# EasyEDA Pro project ProProject_IR sensor board_2024-06-21.epro, board PCB - old
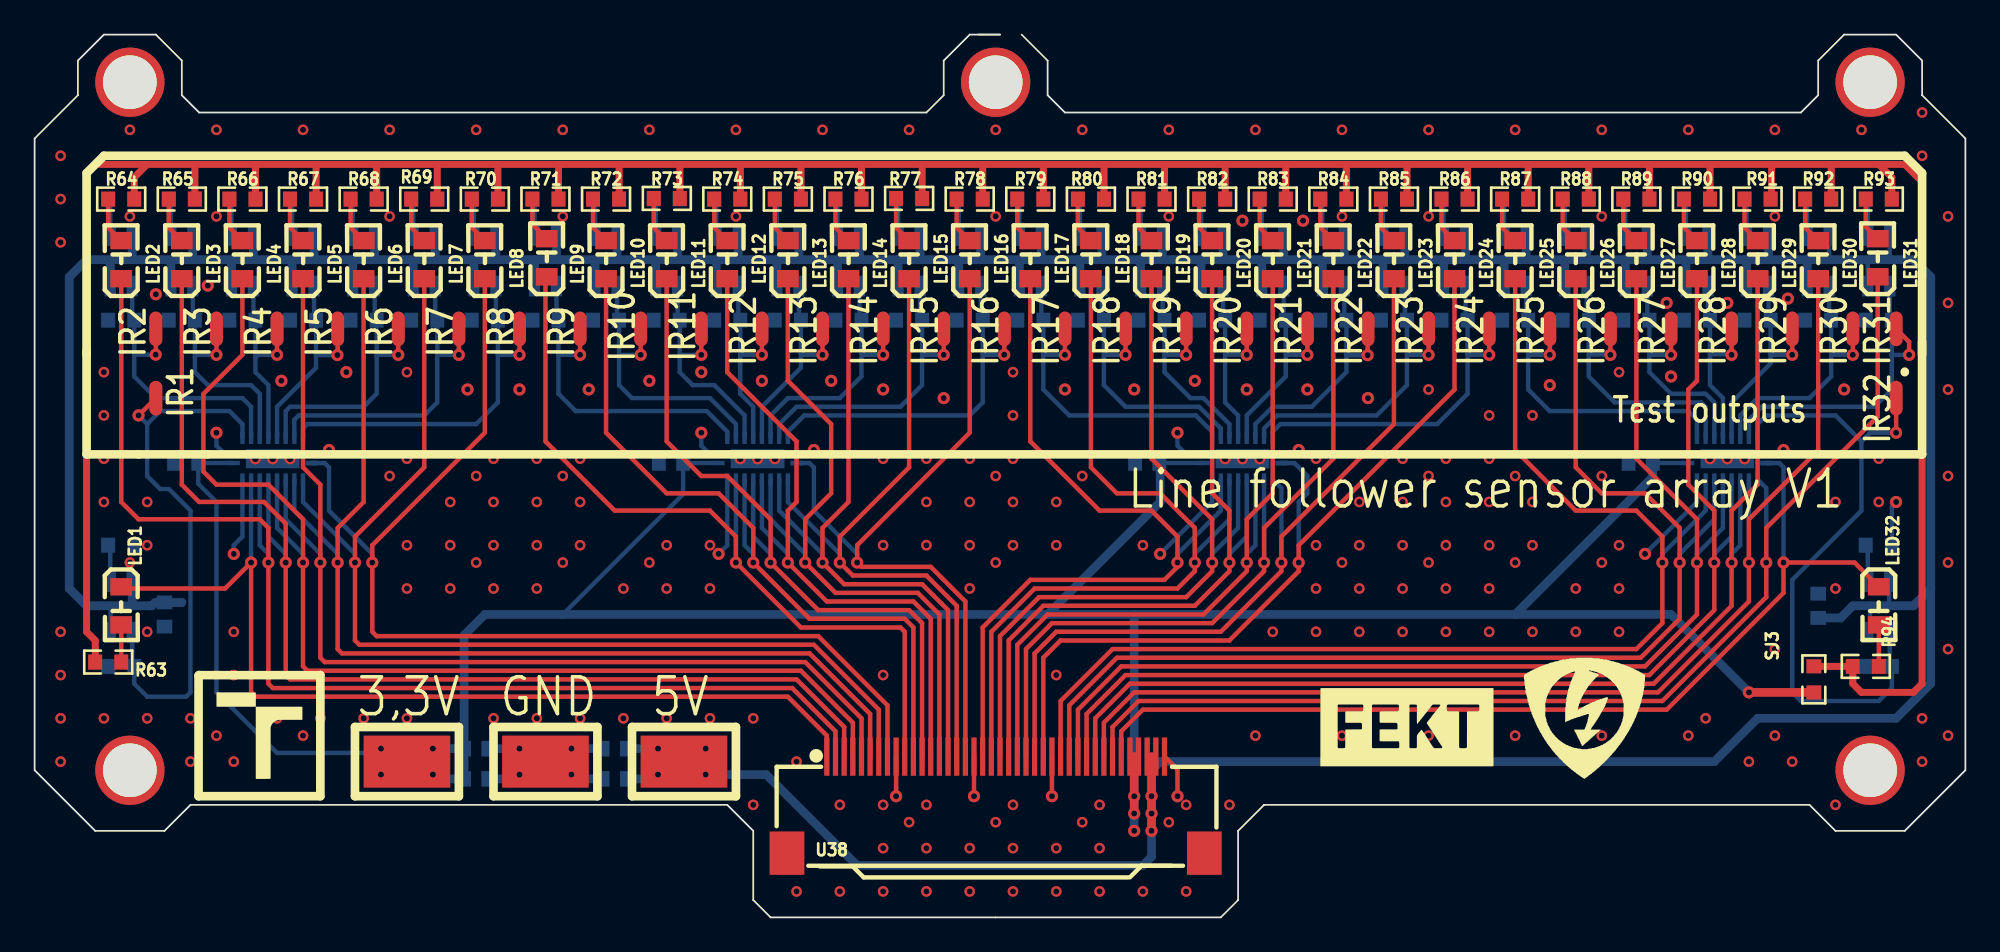
[diagram p1: board, top side]
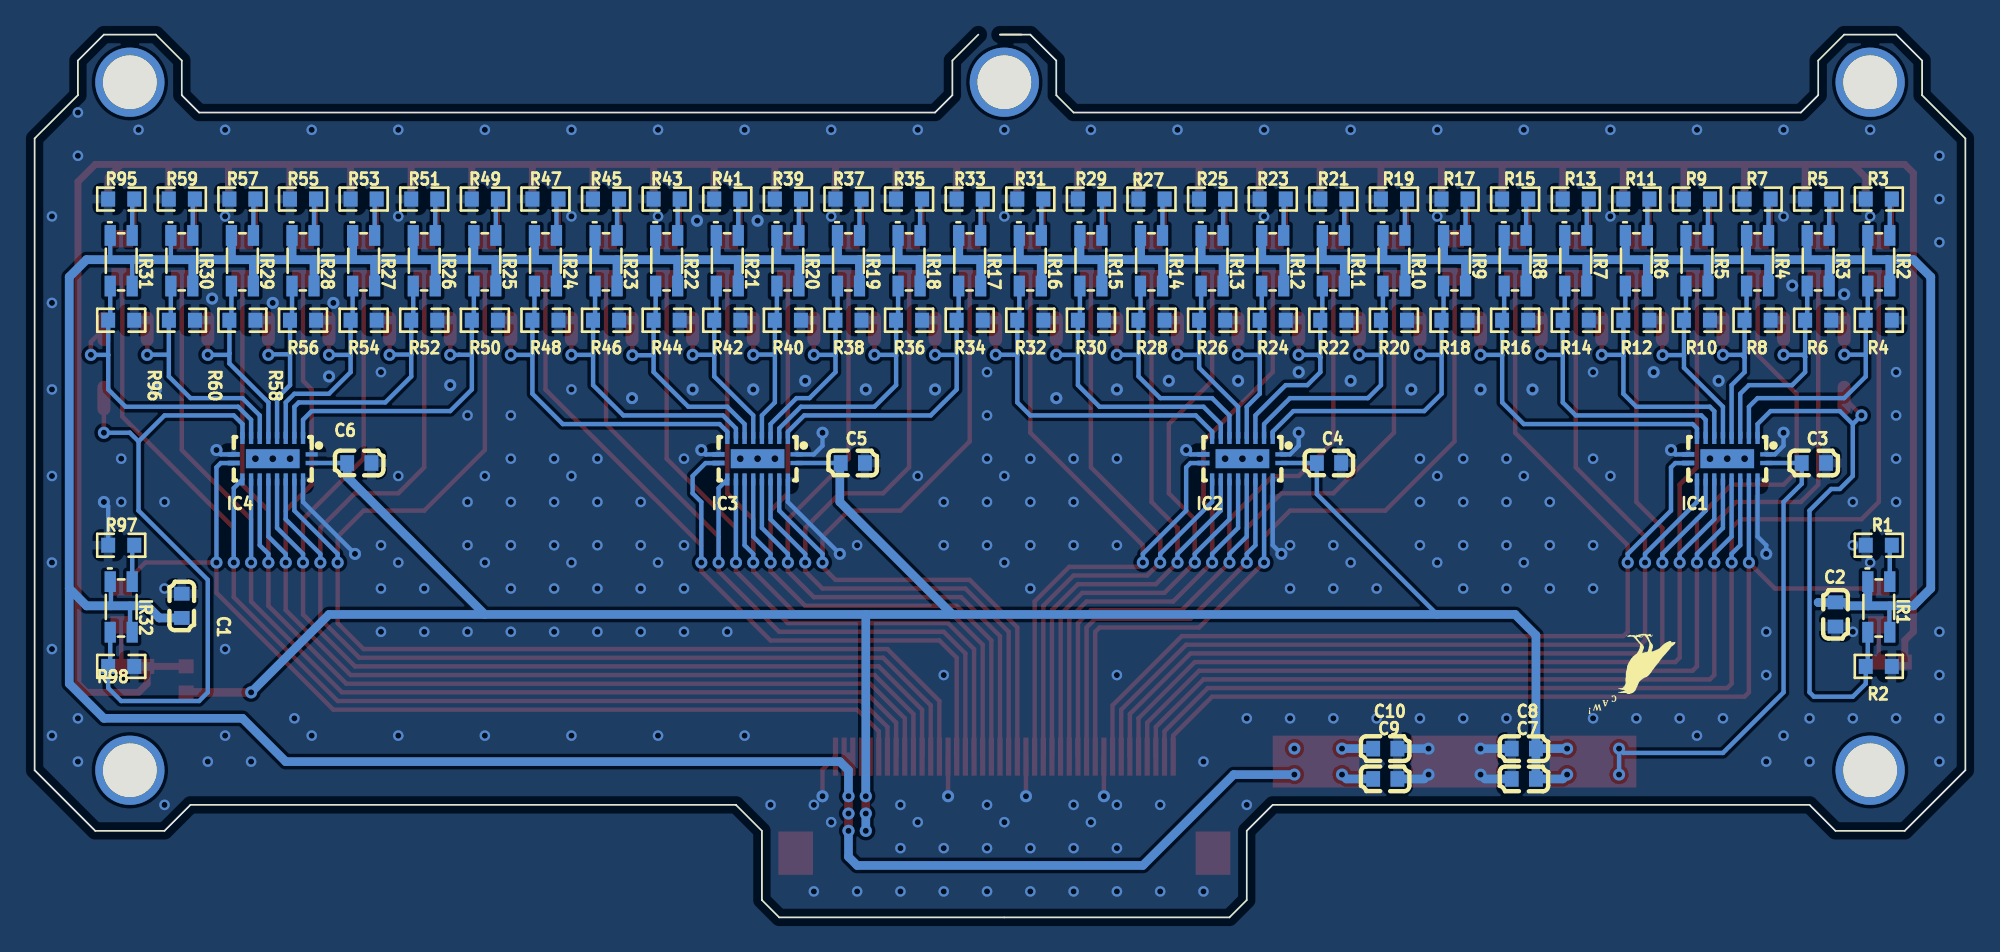
[diagram p2: board, bottom side, seen from below]

Outline 111.5 x 51 mm; copper layers: Top Layer, Bottom Layer. Coordinates in mm from the lower left corner of the outline.
Outline path: 54.5,51 55.75,51 54,51 52.5,49.5 52.5,47.5 51.5,46.5 9.5,46.5 8.5,47.5 8.5,49.5 7,51 4,51 2.5,49.5 2.5,47.5 0,45 0,8.5 3.5,5 7.5,5 9,6.5 40,6.5 41.5,5 41.5,1 42.5,0 68.5,0 69.5,1 69.5,5 71,6.5 102.5,6.5 104,5 108,5 111.5,8.5 111.5,45 109,47.5 109,49.5 107.5,51 104.5,51 103,49.5 103,47.5 102,46.5 59.5,46.5 58.5,47.5 58.5,49.5 57,51
Stack: Top Layer 0.035mm / Dielectric1 1.51mm FR4 er 4.5 / Bottom Layer 0.035mm

## Design rules (mm)
template: JLCPCB Capability(Two Layers Board)
spacing copperThickness1oz (default): track to track 0.102, other pairs 0.152 to 0.3
spacing copperThickness2oz: track to track 0.203, other pairs 0.152 to 0.3
track width copperThickness1oz (default): min 0.127, default 0.254, max 2.54
track width copperThickness2oz: min 0.203, default 0.254, max 2.54
differential pair differentialPair (default): width min 0.127, default 0.254, max 2.54; gap min 0.152, default 0.152
via viaSize (default): diameter min 0.5, default 0.61, max 10; hole min 0.3, default 0.305, max 6.3

## Placement (name value [footprint] x y rotation side)
C1  -  [C0603]  103 18 90 bottom
C2  -  [C0603]  7.5 17.5 270 bottom
C3  -  [C0603]  8.75 26.25 180 bottom
C4  -  [C0603]  36.75 26.25 180 bottom
C5  -  [C0603]  64.25 26.25 180 bottom
C6  -  [C0603]  92.75 26.25 180 bottom
C7  -  [C0603]  25.5 8 0 bottom
C8  -  [C0603]  25.5 9.75 0 bottom
C9  -  [C0603]  33.5 8 180 bottom
C10  -  [C0603]  33.5 9.75 180 bottom
IC1  -  [DHVQFN20_L4.5-W2.5-P0.50-BL-EP]  13.75 26.5 0 bottom
IC2  -  [DHVQFN20_L4.5-W2.5-P0.50-BL-EP]  41.75 26.5 0 bottom
IC3  -  [DHVQFN20_L4.5-W2.5-P0.50-BL-EP]  69.75 26.5 0 bottom
IC4  -  [DHVQFN20_L4.5-W2.5-P0.50-BL-EP]  97.75 26.5 0 bottom
IR1  -  [KU163]  5 18 180 bottom
IR2  -  [KU163]  5 38 180 bottom
IR3  -  [KU163]  8.5 38 180 bottom
IR4  -  [KU163]  12 38 180 bottom
IR5  -  [KU163]  15.5 38 180 bottom
IR6  -  [KU163]  19 38 180 bottom
IR7  -  [KU163]  22.5 38 180 bottom
IR8  -  [KU163]  26 38 180 bottom
IR9  -  [KU163]  29.5 38 180 bottom
IR10  -  [KU163]  33 38 180 bottom
IR11  -  [KU163]  36.5 38 180 bottom
IR12  -  [KU163]  40 38 180 bottom
IR13  -  [KU163]  43.5 38 180 bottom
IR14  -  [KU163]  47 38 180 bottom
IR15  -  [KU163]  50.5 38 180 bottom
IR16  -  [KU163]  54 38 180 bottom
IR17  -  [KU163]  57.5 38 180 bottom
IR18  -  [KU163]  61 38 180 bottom
IR19  -  [KU163]  64.5 38 180 bottom
IR20  -  [KU163]  68 38 180 bottom
IR21  -  [KU163]  71.5 38 180 bottom
IR22  -  [KU163]  75 38 180 bottom
IR23  -  [KU163]  78.5 38 180 bottom
IR24  -  [KU163]  82 38 180 bottom
IR25  -  [KU163]  85.5 38 180 bottom
IR26  -  [KU163]  89 38 180 bottom
IR27  -  [KU163]  92.5 38 180 bottom
IR28  -  [KU163]  96 38 180 bottom
IR29  -  [KU163]  99.5 38 180 bottom
IR30  -  [KU163]  103 38 180 bottom
IR31  -  [KU163]  106.5 38 180 bottom
IR32  -  [KU163]  106.5 18 180 bottom
LED1  -  [LED0805-RD_GREEN]  5 18 270 top
LED2  -  [LED0805-RD_GREEN]  5 38 90 top
LED3  -  [LED0805-RD_GREEN]  8.5 38 90 top
LED4  -  [LED0805-RD_GREEN]  12 38 90 top
LED5  -  [LED0805-RD_GREEN]  15.5 38 90 top
LED6  -  [LED0805-RD_GREEN]  19 38 90 top
LED7  -  [LED0805-RD_GREEN]  22.5 38 90 top
LED8  -  [LED0805-RD_GREEN]  26 38 90 top
LED9  -  [LED0805-RD_GREEN]  29.58 38.11 90 top
LED10  -  [LED0805-RD_GREEN]  33 38 90 top
LED11  -  [LED0805-RD_GREEN]  36.5 38 90 top
LED12  -  [LED0805-RD_GREEN]  40 38 90 top
LED13  -  [LED0805-RD_GREEN]  43.5 38 90 top
LED14  -  [LED0805-RD_GREEN]  47 38 90 top
LED15  -  [LED0805-RD_GREEN]  50.5 38 90 top
LED16  -  [LED0805-RD_GREEN]  54 38 90 top
LED17  -  [LED0805-RD_GREEN]  57.5 38 90 top
LED18  -  [LED0805-RD_GREEN]  61 38 90 top
LED19  -  [LED0805-RD_GREEN]  64.5 38 90 top
LED20  -  [LED0805-RD_GREEN]  68 38 90 top
LED21  -  [LED0805-RD_GREEN]  71.5 38 90 top
LED22  -  [LED0805-RD_GREEN]  75 38 90 top
LED23  -  [LED0805-RD_GREEN]  78.5 38 90 top
LED24  -  [LED0805-RD_GREEN]  82 38 90 top
LED25  -  [LED0805-RD_GREEN]  85.5 38 90 top
LED26  -  [LED0805-RD_GREEN]  89 38 90 top
LED27  -  [LED0805-RD_GREEN]  92.5 38 90 top
LED28  -  [LED0805-RD_GREEN]  96 38 90 top
LED29  -  [LED0805-RD_GREEN]  99.5 38 90 top
LED30  -  [LED0805-RD_GREEN]  103 38 90 top
LED31  -  [LED0805-RD_GREEN]  106.44 38.11 90 top
LED32  -  [LED0805-RD_GREEN]  106.5 18 270 top
NOREF  -  [Pad_e9365]  70 34 90 top
NOREF#2  -  [Pad_e9362]  80.5 34 90 top
NOREF#3  -  [Pad_e9367]  63 34 90 top
NOREF#4  -  [Pad_e9366]  66.5 34 90 top
NOREF#5  -  [Pad_e9358]  94.5 34 90 top
NOREF#6  -  [Pad_e9375]  38.5 34 90 top
NOREF#7  -  [Pad_e9369]  56 34 90 top
NOREF#8  -  [Pad_e9356]  101.5 34 90 top
NOREF#9  -  [Pad_e4480]  37.5 9 0 top
NOREF#10  -  [Pad_e8278]  5.5 48.25 0 top
NOREF#11  -  [Pad_e9355]  105 34 90 top
NOREF#12  -  [Pad_e9389]  7 30 90 top
NOREF#13  -  [Pad_e9378]  28 34 90 top
NOREF#14  -  [Pad_e8274]  55.5 48.25 0 top
NOREF#15  -  [Pad_e9371]  49 34 90 top
NOREF#16  -  [Pad_e4581]  21.5 9 0 top
NOREF#17  -  [Pad_e9379]  24.5 34 90 top
NOREF#18  -  [Pad_e9372]  45.5 34 90 top
NOREF#19  -  [Pad_e8276]  106 48.25 0 top
NOREF#20  -  [Pad_e4442]  106 8.5 0 top
NOREF#21  -  [Pad_e9382]  14 34 90 top
NOREF#22  -  [Pad_e4472]  29.5 9 0 top
NOREF#23  -  [Pad_e9368]  59.5 34 90 top
NOREF#24  -  [Pad_e9360]  87.5 34 90 top
NOREF#25  -  [Pad_e9357]  98 34 90 top
NOREF#26  -  [Pad_e9363]  77 34 90 top
NOREF#27  -  [Pad_e9380]  21 34 90 top
NOREF#28  -  [Pad_e9394]  107.5 30 90 top
NOREF#29  -  [Pad_e9376]  35 34 90 top
NOREF#30  -  [Pad_e9385]  7 34 90 top
NOREF#31  -  [Pad_e9383]  10.5 34 90 top
NOREF#32  -  [Pad_e9377]  31.5 34 90 top
NOREF#33  -  [Pad_e4440]  5.5 8.5 0 top
NOREF#34  -  [Pad_e9381]  17.5 34 90 top
NOREF#35  -  [Pad_e9370]  52.5 34 90 top
NOREF#36  -  [Pad_e9364]  73.5 34 90 top
NOREF#37  -  [Pad_e9373]  42 34 90 top
NOREF#38  -  [Pad_e9359]  91 34 90 top
NOREF#39  -  [Pad_e9354]  107.5 34 90 top
NOREF#40  -  [Pad_e9361]  84 34 90 top
R1  -  [R0603]  5 21.5 0 bottom
R2  -  [R0603]  5 14.5 0 bottom
R3  -  [R0603]  5 41.5 0 bottom
R4  -  [R0603]  5 34.5 0 bottom
R5  -  [R0603]  8.5 41.5 0 bottom
R6  -  [R0603]  8.5 34.5 0 bottom
R7  -  [R0603]  12 41.5 0 bottom
R8  -  [R0603]  12 34.5 0 bottom
R9  -  [R0603]  15.5 41.5 0 bottom
R10  -  [R0603]  15.5 34.5 0 bottom
R11  -  [R0603]  19 41.5 0 bottom
R12  -  [R0603]  19 34.5 0 bottom
R13  -  [R0603]  22.5 41.5 0 bottom
R14  -  [R0603]  22.5 34.5 0 bottom
R15  -  [R0603]  26 41.5 0 bottom
R16  -  [R0603]  26 34.5 0 bottom
R17  -  [R0603]  29.5 41.5 0 bottom
R18  -  [R0603]  29.5 34.5 0 bottom
R19  -  [R0603]  33 41.5 0 bottom
R20  -  [R0603]  33 34.5 0 bottom
R21  -  [R0603]  36.5 41.5 0 bottom
R22  -  [R0603]  36.5 34.5 0 bottom
R23  -  [R0603]  40 41.5 0 bottom
R24  -  [R0603]  40 34.5 0 bottom
R25  -  [R0603]  43.5 41.5 0 bottom
R26  -  [R0603]  43.5 34.5 0 bottom
R27  -  [R0603]  47 41.5 0 bottom
R28  -  [R0603]  47 34.5 0 bottom
R29  -  [R0603]  50.5 41.5 0 bottom
R30  -  [R0603]  50.5 34.5 0 bottom
R31  -  [R0603]  54 41.5 0 bottom
R32  -  [R0603]  54 34.5 0 bottom
R33  -  [R0603]  57.5 41.5 0 bottom
R34  -  [R0603]  57.5 34.5 0 bottom
R35  -  [R0603]  61 41.5 0 bottom
R36  -  [R0603]  61 34.5 0 bottom
R37  -  [R0603]  64.5 41.5 0 bottom
R38  -  [R0603]  64.5 34.5 0 bottom
R39  -  [R0603]  68 41.5 0 bottom
R40  -  [R0603]  68 34.5 0 bottom
R41  -  [R0603]  71.5 41.5 0 bottom
R42  -  [R0603]  71.5 34.5 0 bottom
R43  -  [R0603]  75 41.5 0 bottom
R44  -  [R0603]  75 34.5 0 bottom
R45  -  [R0603]  78.5 41.5 0 bottom
R46  -  [R0603]  78.5 34.5 0 bottom
R47  -  [R0603]  82 41.5 0 bottom
R48  -  [R0603]  82 34.5 0 bottom
R49  -  [R0603]  85.5 41.5 0 bottom
R50  -  [R0603]  85.5 34.5 0 bottom
R51  -  [R0603]  89 41.5 0 bottom
R52  -  [R0603]  89 34.5 0 bottom
R53  -  [R0603]  92.5 41.5 0 bottom
R54  -  [R0603]  92.5 34.5 0 bottom
R55  -  [R0603]  96 41.5 0 bottom
R56  -  [R0603]  96 34.5 0 bottom
R57  -  [R0603]  99.5 41.5 0 bottom
R58  -  [R0603]  99.5 34.5 0 bottom
R59  -  [R0603]  103 41.5 0 bottom
R60  -  [R0603]  102.99 34.5 0 bottom
R63  -  [R0603]  4.25 14.75 180 top
R64  -  [R0603]  5 41.5 0 top
R65  -  [R0603]  8.5 41.5 0 top
R66  -  [R0603]  12 41.5 0 top
R67  -  [R0603]  15.5 41.5 0 top
R68  -  [R0603]  19 41.5 0 top
R69  -  [R0603]  22.5 41.5 0 top
R70  -  [R0603]  26 41.5 0 top
R71  -  [R0603]  29.5 41.5 0 top
R72  -  [R0603]  33 41.5 0 top
R73  -  [R0603]  36.51 41.54 0 top
R74  -  [R0603]  40 41.5 0 top
R75  -  [R0603]  43.5 41.5 0 top
R76  -  [R0603]  47 41.5 0 top
R77  -  [R0603]  50.5 41.54 0 top
R78  -  [R0603]  54 41.5 0 top
R79  -  [R0603]  57.5 41.5 0 top
R80  -  [R0603]  61 41.5 0 top
R81  -  [R0603]  64.5 41.5 0 top
R82  -  [R0603]  68 41.5 0 top
R83  -  [R0603]  71.5 41.5 0 top
R84  -  [R0603]  75 41.5 0 top
R85  -  [R0603]  78.5 41.5 0 top
R86  -  [R0603]  82 41.5 0 top
R87  -  [R0603]  85.5 41.5 0 top
R88  -  [R0603]  89 41.5 0 top
R89  -  [R0603]  92.5 41.5 0 top
R90  -  [R0603]  96 41.5 0 top
R91  -  [R0603]  99.5 41.5 0 top
R92  -  [R0603]  103 41.5 0 top
R93  -  [R0603]  106.5 41.5 0 top
R94  -  [R0603]  105.75 14.5 180 top
R95  -  [R0603]  106.5 41.5 0 bottom
R96  -  [R0603]  106.5 34.5 0 bottom
R97  -  [R0603]  106.5 21.5 0 bottom
R98  -  [R0603]  106.5 14.5 0 bottom
SJ3  -  [R0603]  102.75 13.75 270 top
U38  -  [CONN-SMD_40P-P0.50_F31L-1A7H1-21040]  55.5 6.5 0 top

## Footprints (pads in the part's own frame, mm; a bottom-side part is the same pattern mirrored in y, then rotated)
C0603
  rect 0.8x0.9 smd: 1(-0.7,0) 2(0.7,0)
CONN-SMD_40P-P0.50_F31L-1A7H1-21040
  rect 0.3x2.2 smd: 1(-9.75,2.788) 2(-9.25,2.788) 3(-8.75,2.788) 4(-8.25,2.788) 5(-7.75,2.788) 6(-7.25,2.788) 7(-6.75,2.788) 8(-6.25,2.788) 9(-5.75,2.788) 10(-5.25,2.788) 11(-4.75,2.788) 12(-4.25,2.788) 13(-3.75,2.788) 14(-3.25,2.788) 15(-2.75,2.788) 16(-2.25,2.788) 17(-1.75,2.788) 18(-1.25,2.788) 19(-0.75,2.788) 20(-0.25,2.788) 21(0.25,2.788) 22(0.75,2.788) 23(1.25,2.788) 24(1.75,2.788) 25(2.25,2.788) 26(2.75,2.788) 27(3.25,2.788) 28(3.75,2.788) 29(4.25,2.788) 30(4.75,2.788) 31(5.25,2.788) 32(5.75,2.788) 33(6.25,2.788) 34(6.75,2.788) 35(7.25,2.788) 36(7.75,2.788) 37(8.25,2.788) 38(8.75,2.788) 39(9.25,2.788) 40(9.75,2.788)
  rect 2x2.5 smd: 41(-12.05,-2.788) 42(12.05,-2.788)
DHVQFN20_L4.5-W2.5-P0.50-BL-EP
  rect 0.7x0.25 smd: 1(-2.251,-0.249) 20(-2.251,0.249)
  rect 0.25x0.7 smd: 2(-1.75,-1.2) 3(-1.25,-1.2) 4(-0.75,-1.2) 5(-0.25,-1.2) 6(0.25,-1.2) 7(0.75,-1.2) 8(1.25,-1.2) 9(1.75,-1.2) 12(1.75,1.2) 13(1.25,1.2) 14(0.75,1.2) 15(0.25,1.2) 16(-0.25,1.2) 17(-0.75,1.2) 18(-1.25,1.2) 19(-1.75,1.2)
  rect 0.7x0.28 smd: 10(2.251,-0.249) 11(2.251,0.251)
  rect 3.1x1.1 smd: 21(0,0.001)
KU163
  rect 0.65x1.2 smd: 1(-0.635,1.397) 2(0.635,1.397) 3(-0.635,-1.524) 4(0.635,-1.524)
LED0805-RD_GREEN
  rect 1x1.25 smd: 1(-1.1,0) 2(1.1,0)
Pad_e4440
  round 4 hole 3.1: 1(0,0)
Pad_e4442
  round 4 hole 3.1: 1(0,0)
Pad_e4472
  rect 5x3 smd: 2(0,0)
Pad_e4480
  rect 5x3 smd: 43(0,0)
Pad_e4581
  rect 5x3 smd: 44(0,0)
Pad_e8274
  round 4 hole 3.1: 45(0,0)
Pad_e8276
  round 4 hole 3.1: 45(0,0)
Pad_e8278
  round 4 hole 3.1: 45(0,0)
Pad_e9354
  oval 2x0.75 smd: 45(0,0)
Pad_e9355
  oval 2x0.75 smd: 46(0,0)
Pad_e9356
  oval 2x0.75 smd: 47(0,0)
Pad_e9357
  oval 2x0.75 smd: 48(0,0)
Pad_e9358
  oval 2x0.75 smd: 49(0,0)
Pad_e9359
  oval 2x0.75 smd: 50(0,0)
Pad_e9360
  oval 2x0.75 smd: 51(0,0)
Pad_e9361
  oval 2x0.75 smd: 52(0,0)
Pad_e9362
  oval 2x0.75 smd: 53(0,0)
Pad_e9363
  oval 2x0.75 smd: 54(0,0)
Pad_e9364
  oval 2x0.75 smd: 55(0,0)
Pad_e9365
  oval 2x0.75 smd: 56(0,0)
Pad_e9366
  oval 2x0.75 smd: 57(0,0)
Pad_e9367
  oval 2x0.75 smd: 58(0,0)
Pad_e9368
  oval 2x0.75 smd: 59(0,0)
Pad_e9369
  oval 2x0.75 smd: 60(0,0)
Pad_e9370
  oval 2x0.75 smd: 61(0,0)
Pad_e9371
  oval 2x0.75 smd: 62(0,0)
Pad_e9372
  oval 2x0.75 smd: 63(0,0)
Pad_e9373
  oval 2x0.75 smd: 64(0,0)
Pad_e9375
  oval 2x0.75 smd: 65(0,0)
Pad_e9376
  oval 2x0.75 smd: 66(0,0)
Pad_e9377
  oval 2x0.75 smd: 67(0,0)
Pad_e9378
  oval 2x0.75 smd: 68(0,0)
Pad_e9379
  oval 2x0.75 smd: 69(0,0)
Pad_e9380
  oval 2x0.75 smd: 70(0,0)
Pad_e9381
  oval 2x0.75 smd: 71(0,0)
Pad_e9382
  oval 2x0.75 smd: 72(0,0)
Pad_e9383
  oval 2x0.75 smd: 73(0,0)
Pad_e9385
  oval 2x0.75 smd: 74(0,0)
Pad_e9389
  oval 2x0.75 smd: 75(0,0)
Pad_e9394
  oval 2x0.75 smd: 76(0,0)
R0603
  rect 0.806x0.864 smd: 1(-0.753,0) 2(0.753,0)

## Nets
+5V: C1.1 C2.1 C9.1 C10.1 IR1.1 IR1.4 IR2.1 IR2.4 IR3.1 IR3.4 IR4.1 IR4.4 IR5.1 IR5.4 IR6.1 IR6.4 IR7.1 IR7.4 IR8.1 IR8.4 IR9.1 IR9.4 IR10.1 IR10.4 IR11.1 IR11.4 IR12.1 IR12.4 IR13.1 IR13.4 IR14.1 IR14.4 IR15.1 IR15.4 IR16.1 IR16.4 IR17.1 IR17.4 IR18.1 IR18.4 IR19.1 IR19.4 IR20.1 IR20.4 IR21.1 IR21.4 IR22.1 IR22.4 IR23.1 IR23.4 IR24.1 IR24.4 IR25.1 IR25.4 IR26.1 IR26.4 IR27.1 IR27.4 IR28.1 IR28.4 IR29.1 IR29.4 IR30.1 IR30.4 IR31.1 IR31.4 IR32.1 IR32.4 NOREF#9.43 U38.38 U38.39
AGND: C1.2 C2.2 C3.2 C4.2 C5.2 C6.2 C7.2 C8.2 C9.2 C10.2 IC1.1 IC1.10 IC1.19 IC1.21 IC2.1 IC2.10 IC2.19 IC2.21 IC3.1 IC3.10 IC3.19 IC3.21 IC4.1 IC4.10 IC4.19 IC4.21 NOREF#22.2 R1.2 R2.1 R3.2 R4.1 R5.2 R6.1 R7.2 R8.1 R9.2 R10.1 R11.2 R12.1 R13.2 R14.1 R15.2 R16.1 R17.2 R18.1 R19.2 R20.1 R21.2 R22.1 R23.2 R24.1 R25.2 R26.1 R27.2 R28.1 R29.2 R30.1 R31.2 R32.1 R33.2 R34.1 R35.2 R36.1 R37.2 R38.1 R39.2 R40.1 R41.2 R42.1 R43.2 R44.1 R45.2 R46.1 R47.2 R48.1 R49.2 R50.1 R51.2 R52.1 R53.2 R54.1 R55.2 R56.1 R57.2 R58.1 R59.2 R60.1 R95.2 R96.1 R97.2 R98.1 U38.9 U38.18 U38.27 U38.40
VCC: C3.1 C4.1 C5.1 C6.1 C7.1 C8.1 IC1.20 IC2.20 IC3.20 IC4.20 NOREF#16.44 SJ3.2 U38.36 U38.37
DIR1: IC1.18 LED1.1 U38.1
DIR2: IC1.17 LED2.1 U38.2
DIR3: IC1.16 LED3.1 U38.3
DIR4: IC1.15 LED4.1 U38.4
DIR5: IC1.14 LED5.1 U38.5
DIR6: IC1.13 LED6.1 U38.6
DIR7: IC1.12 LED7.1 U38.7
DIR8: IC1.11 LED8.1 U38.8
DIR9: IC2.18 LED9.1 U38.10
DIR10: IC2.17 LED10.1 U38.11
DIR11: IC2.16 LED11.1 U38.12
DIR12: IC2.15 LED12.1 U38.13
DIR13: IC2.14 LED13.1 U38.14
DIR14: IC2.13 LED14.1 U38.15
DIR15: IC2.12 LED15.1 U38.16
DIR16: IC2.11 LED16.1 U38.17
DIR17: IC3.18 LED17.1 U38.19
DIR18: IC3.17 LED18.1 U38.20
DIR19: IC3.16 LED19.1 U38.21
DIR20: IC3.15 LED20.1 U38.22
DIR21: IC3.14 LED21.1 U38.23
DIR22: IC3.13 LED22.1 U38.24
DIR23: IC3.12 LED23.1 U38.25
DIR24: IC3.11 LED24.1 U38.26
DIR25: IC4.18 LED25.1 U38.28
DIR26: IC4.17 LED26.1 U38.29
DIR27: IC4.16 LED27.1 U38.30
DIR28: IC4.15 LED28.1 U38.31
DIR29: IC4.14 LED29.1 U38.32
DIR30: IC4.13 LED30.1 U38.33
DIR31: IC4.12 LED31.1 U38.34
DIR32: IC4.11 LED32.1 U38.35
IR1: IC1.2 IR1.3 NOREF#12.75 R2.2
IR2: IC1.3 IR2.3 NOREF#30.74 R4.2
IR3: IC1.4 IR3.3 NOREF#31.73 R6.2
IR4: IC1.5 IR4.3 NOREF#21.72 R8.2
IR5: IC1.6 IR5.3 NOREF#34.71 R10.2
IR6: IC1.7 IR6.3 NOREF#27.70 R12.2
IR7: IC1.8 IR7.3 NOREF#17.69 R14.2
IR8: IC1.9 IR8.3 NOREF#13.68 R16.2
IR9: IC2.2 IR9.3 NOREF#32.67 R18.2
IR10: IC2.3 IR10.3 NOREF#29.66 R20.2
IR11: IC2.4 IR11.3 NOREF#6.65 R22.2
IR12: IC2.5 IR12.3 NOREF#37.64 R24.2
IR13: IC2.6 IR13.3 NOREF#18.63 R26.2
IR14: IC2.7 IR14.3 NOREF#15.62 R28.2
IR15: IC2.8 IR15.3 NOREF#35.61 R30.2
IR16: IC2.9 IR16.3 NOREF#7.60 R32.2
IR17: IC3.2 IR17.3 NOREF#23.59 R34.2
IR18: IC3.3 IR18.3 NOREF#3.58 R36.2
IR19: IC3.4 IR19.3 NOREF#4.57 R38.2
IR20: IC3.5 IR20.3 NOREF.56 R40.2
IR21: IC3.6 IR21.3 NOREF#36.55 R42.2
IR22: IC3.7 IR22.3 NOREF#26.54 R44.2
IR23: IC3.8 IR23.3 NOREF#2.53 R46.2
IR24: IC3.9 IR24.3 NOREF#40.52 R48.2
IR25: IC4.2 IR25.3 NOREF#24.51 R50.2
IR26: IC4.3 IR26.3 NOREF#38.50 R52.2
IR27: IC4.4 IR27.3 NOREF#5.49 R54.2
IR28: IC4.5 IR28.3 NOREF#25.48 R56.2
IR29: IC4.6 IR29.3 NOREF#8.47 R58.2
IR30: IC4.7 IR30.3 NOREF#11.46 R60.2
IR31: IC4.8 IR31.3 NOREF#39.45 R96.2
IR32: IC4.9 IR32.3 NOREF#28.76 R98.2
$1N6653: IR2.2 R3.1
$1N6781: IR3.2 R5.1
$1N6909: IR4.2 R7.1
$1N7037: IR5.2 R9.1
$1N7165: IR6.2 R11.1
$1N7293: IR7.2 R13.1
$1N7421: IR8.2 R15.1
$1N7549: IR9.2 R17.1
$1N7677: IR10.2 R19.1
$1N7805: IR11.2 R21.1
$1N7933: IR12.2 R23.1
$1N8061: IR13.2 R25.1
$1N8189: IR14.2 R27.1
$1N8317: IR15.2 R29.1
$1N8445: IR16.2 R31.1
$1N10253: IR17.2 R33.1
$1N10265: IR18.2 R35.1
$1N10277: IR19.2 R37.1
$1N10289: IR20.2 R39.1
$1N10301: IR21.2 R41.1
$1N10313: IR22.2 R43.1
$1N10325: IR23.2 R45.1
$1N10337: IR24.2 R47.1
$1N10349: IR25.2 R49.1
$1N10361: IR26.2 R51.1
$1N10373: IR27.2 R53.1
$1N10385: IR28.2 R55.1
$1N10397: IR29.2 R57.1
$1N10409: IR30.2 R59.1
$1N20190: LED1.2 R63.1
$1N20287: LED2.2 R64.1
$1N20383: LED3.2 R65.1
$1N20385: LED4.2 R66.1
$1N20575: LED5.2 R67.1
$1N20577: LED6.2 R68.1
$1N20579: LED7.2 R69.1
$1N20581: LED8.2 R70.1
$1N20959: LED9.2 R71.1
$1N20961: LED10.2 R72.1
$1N20963: LED11.2 R73.1
$1N20965: LED12.2 R74.1
$1N20967: LED13.2 R75.1
$1N20969: LED14.2 R76.1
$1N20971: LED15.2 R77.1
$1N20973: LED16.2 R78.1
$1N22511: LED17.2 R79.1
$1N22513: LED18.2 R80.1
$1N22515: LED19.2 R81.1
$1N22517: LED20.2 R82.1
$1N22519: LED21.2 R83.1
$1N22521: LED22.2 R84.1
$1N22523: LED23.2 R85.1
$1N22525: LED24.2 R86.1
$1N22527: LED25.2 R87.1
$1N22529: LED26.2 R88.1
$1N22531: LED27.2 R89.1
$1N22533: LED28.2 R90.1
$1N22535: LED29.2 R91.1
$1N22537: LED30.2 R92.1
$1N22539: LED31.2 R93.1
$1N22541: LED32.2 R94.1
$1N26335: IR1.2 R1.1
$1N29013: R63.2 R64.2 R65.2 R66.2 R67.2 R68.2 R69.2 R70.2 R71.2 R72.2 R73.2 R74.2 R75.2 R76.2 R77.2 R78.2 R79.2 R80.2 R81.2 R82.2 R83.2 R84.2 R85.2 R86.2 R87.2 R88.2 R89.2 R90.2 R91.2 R92.2 R93.2 R94.2 SJ3.1
$1N30161: IR31.2 R95.1
$1N30166: IR32.2 R97.1

Pads without a net: NOREF#10 45; NOREF#14 45; NOREF#19 45; NOREF#20 1; NOREF#33 1; U38 41 42

## Via types
v1: diameter 0.7, hole 0.35, Top Layer to Bottom Layer, 126 vias
v2: diameter 0.61, hole 0.35, Top Layer to Bottom Layer, 217 vias
v3: diameter 0.65, hole 0.4, Top Layer to Bottom Layer, 12 vias

## Routing (per net, layer and track width the routed paths; a pad name or vN(x,y) marks a point on that pad's centre or on a via; arc(x,y) is an arc through that point)
+5V: length 344.6
  Top Layer w0.254: U38.38 U38.39
  Top Layer w0.5: v1(64.5,5) v1(64.5,6) v1(64.5,7) 64.5,7 64.5,9.29
  Bottom Layer w0.254: IR1.4 4.39,16.5 4.39,18 ; 105.99,18 105.99,16.6 IR32.4 ; IR31.1 107.13,38.04 107.18,38 ; IR32.1 107.09,19.36 107.09,18 ; 103.58,38 103.63,38.05 IR30.1 ; 105.8,38 105.87,37.94 IR31.4
  Bottom Layer w0.5: v1(38.75,8.25) 42.25,8.25 47.5,3 64,3 64.5,3.5 v1(64.5,5) ; v1(64.5,7) 64.5,8.5 65,9 97,9 99.5,11.5 107.5,11.5 109.5,13.5 109.5,19 ; C10.1 v1(36,9.75) ; C9.1 35.75,8 v1(36,8.25)
  Bottom Layer w0.508: IR23.4 77.87,38 ; 21.89,38 19.61,38 ; 21.89,38 23.12,38 ; 21.89,38 21.86,37.98 IR7.4 ; 19.61,38 18.41,38 ; 19.61,38 19.64,38.02 IR6.1 ; 39.36,38 39.37,38 IR12.4 ; 39.36,38 37.14,38 ; 39.36,38 40.63,38 ; 42.86,38 40.63,38 ; 42.86,38 42.87,37.99 IR13.4 ; 42.86,38 49.87,38 ; 40.63,38 40.63,38 IR12.1 ; 60.37,38 58.13,38 ; 60.37,38 61.63,38 ; 60.37,38 60.37,37.99 IR18.4 ; 58.13,38 IR17.1 ; 58.13,38 54.63,38 ; 11.46,38 11.36,37.91 IR4.4 ; 11.46,38 9.15,38 ; 11.46,38 12.63,38 ; 98.86,38 98.87,37.99 IR29.4 ; 98.86,38 100,38 ; 98.86,38 96.63,38 ; 9.15,38 7.96,38 ; 9.15,38 9.14,38.02 IR3.1 ; 7.96,38 7.86,37.9 IR3.4 ; 7.96,38 5.64,38 ; IR16.1 54.63,38 54.63,38 ; IR14.4 46.37,38 ; 93.14,38 91.87,38 ; 93.14,38 96.63,38 ; 93.14,38 93.13,38 IR27.1 ; 91.87,38 89.64,38 ; 91.87,38 91.87,38 IR27.4 ; IR8.4 25.36,37.99 25.36,38 ; IR7.1 23.14,38.01 23.12,38 ; IR6.4 18.36,37.95 18.41,38 ; 4.5,38 5.64,38 ; 4.5,38 4.36,37.86 IR2.4 ; 4.5,38 3,38 2,37 2,19 3,18 5.64,18 ; 5.64,38 5.64,38 IR2.1 ; 72.13,38 72.13,38 IR21.1 ; 72.13,38 68.61,38 ; 72.13,38 75.63,38 ; IR15.4 49.87,38 49.87,38 ; 100,38 102.36,38 IR30.4 ; 100,38 100.13,38.14 IR29.1 ; 37.14,38 33.65,38 ; 37.14,38 37.13,38 IR11.1 ; 33.65,38 30.14,38 ; 33.65,38 33.63,38.01 IR10.1 ; 82.64,38 79.12,38 ; 82.64,38 82.63,38 IR24.1 ; 82.64,38 86.15,38 ; 79.12,38 79.13,38.02 IR23.1 ; 79.12,38 75.63,38 ; 18.41,38 16.13,38 ; 16.13,38 16.14,38.01 IR5.1 ; 16.13,38 14.88,38 ; 61.63,38 61.63,38.01 IR18.1 ; 61.63,38 63.87,38 ; 8.5,18.2 8.49,18.19 6.95,18.19 6.77,18 5.64,18 ; IR22.1 75.63,38.01 75.63,38 ; IR19.1 65.13,38 65.14,38 ; 30.14,38 IR9.1 ; 30.14,38 26.64,38 ; 12.63,38 12.64,38.01 IR4.1 ; 12.63,38 14.88,38 ; IR28.4 95.37,38 ; 96.63,38 96.63,38 IR28.1 ; 54.63,38 53.37,38 ; 89.64,38 89.63,38.01 IR26.1 ; 89.64,38 86.15,38 ; IR15.1 51.13,38 51.13,38 ; 25.36,38 23.12,38 ; 25.36,38 26.64,38 ; 63.87,38 63.87,38 IR19.4 ; 63.87,38 65.14,38 ; 86.15,38 86.13,38.01 IR25.1 ; 102.37,38 108.5,38 109.5,37 109.5,19 108.5,18 105,18 104.3,17.3 C1.1 ; IR5.4 14.86,37.99 14.88,38 ; 53.37,38 53.37,38 IR16.4 ; 53.37,38 51.13,38 ; IR20.1 68.63,38.02 68.61,38 ; 68.61,38 65.14,38 ; 51.13,38 49.87,38 ; IR26.4 88.37,38 ; IR8.1 26.64,38.01 26.64,38 ; IR9.4 28.86,38 ; IR1.1 5.64,18 ; IR20.4 67.37,38 ; IR11.4 35.87,38 ; IR24.4 81.37,38 ; IR21.4 70.87,38 ; IR22.4 74.37,38 ; IR13.1 44.13,38 ; IR10.4 32.37,38 ; IR14.1 47.63,38 ; IR25.4 84.87,38 ; IR17.4 56.87,38
  vias: v1(38.75,9.75)
AGND: length 50.4
  Top Layer w0.254: v1(66,7) 66,8.54 U38.40 ; v1(49.75,7) U38.9 ; U38.18 v1(54.25,7) ; v1(58.75,7) U38.27
  Bottom Layer w0.254: IC2.19 40,21.5 v1(39.5,21) ; IC2.1 39,26.75 38.5,27.25 v1(38.5,28) ; IC1.19 12,22 11.5,21.5 v1(11.5,21) ; v1(107.5,24) 107.25,23.75 R97.2 ; IC4.19 96,24 v1(93,21) ; IC4.10 100.75,26.75 v1(101,27) ; v1(66,28) 66,27.25 66.5,26.75 IC3.1 ; IC1.1 11,26.75 10.5,27.25 v1(10.5,28) ; v1(65,21) 68,24 IC3.19 ; IC3.10 72.75,26.75 v1(73,27) ; IC2.10 44.75,26.75 v1(45,27) ; v1(17,27) 16.75,26.75 IC1.10
  Bottom Layer w0.5: v1(31,9.75) C10.2 ; C8.2 v1(28,9.75) ; C9.2 31.25,8 v1(31,8.25) ; v1(28,8.25) 27.75,8 C7.2
  vias: v1(7,36) v1(10,36.5) v1(14.25,31) v1(18,31.5) v1(25,30.5) v1(28,30.5) v1(32,30.5) v1(35.5,31) v1(38.5,31.5) v1(42,31) v1(46,31) v1(49,30.5) v1(52.5,30) v1(59.5,30.5) v1(63.5,30.5) v1(67,31) v1(69.75,40.25) v1(70,30.5) v1(73.25,40.25) v1(73.5,30.5) v1(77,30) v1(87.5,30.75) v1(94.25,35.5) v1(94.5,31.25) v1(97.75,35.5) v1(101.25,35.75) v1(104.5,30.5) v2(1.5,44) v2(1.5,41.5) v2(1.5,39) v2(1.5,16.5) v2(1.5,14) v2(1.5,11.5) v2(1.5,9) v2(4,31.5) v2(4,29) v2(4,26.5) v2(4,24) v2(4,11.5) v2(5.5,45.5) v2(5.5,40.5) v2(5.5,20.5) v2(6.5,24) v2(6.5,21.5) v2(6.5,16.5) v2(6.5,11.5) v2(9,11.5) v2(9,9) v2(10.5,45.5) v2(10.5,40.5) v2(10.5,10.5) v2(11.5,16.5) v2(11.5,14) v2(11.5,9) v2(14,11.5) v2(15.5,45.5) v2(15.5,10.5) v2(16.5,11.5) v2(19,11.5) v2(20.5,45.5) v2(20.5,40.5) v2(20.5,25.5) v2(21.5,31.5) v2(21.5,26.5) v2(21.5,21.5) v2(21.5,19) v2(21.5,11.5) v2(24,24) v2(24,21.5) v2(24,19) v2(25.5,45.5) v2(25.5,25.5) v2(25.5,20.5) v2(26.5,26.5) v2(26.5,24) v2(26.5,21.5) v2(26.5,19) v2(26.5,11.5) v2(29,26.5) v2(29,24) v2(29,21.5) v2(29,19) v2(29,11.5) v2(30.5,45.5) v2(30.5,40.5) v2(30.5,25.5) v2(30.5,20.5) v2(31.5,26.5) v2(31.5,24) v2(31.5,21.5) v2(31.5,11.5) v2(34,19) v2(34,11.5) v2(35.5,45.5) v2(35.5,20.5) v2(36.5,21.5) v2(36.5,19) v2(36.5,11.5) v2(39,21.5) v2(39,19) v2(39,11.5) v2(40.5,45.5) v2(40.5,40.5) v2(41.5,11.5) v2(41.5,6.5) v2(44,9) v2(44,1.5) v2(45.5,45.5) v2(46.5,6.5) v2(46.5,1.5) v2(49,26.5) v2(49,21.5) v2(49,14) v2(49,6.5) v2(49,4) v2(49,1.5) v2(50.5,45.5) v2(50.5,5.5) v2(51.5,26.5) v2(51.5,24) v2(51.5,21.5) v2(51.5,6.5) v2(51.5,4) v2(51.5,1.5) v2(54,26.5) v2(54,24) v2(54,21.5) v2(54,19) v2(54,4) v2(54,1.5) v2(55.5,45.5) v2(55.5,40.5) v2(55.5,25.5) v2(55.5,20.5) v2(55.5,5.5) v2(56.5,31.5) v2(56.5,29) v2(56.5,26.5) v2(56.5,24) v2(56.5,21.5) v2(56.5,6.5) v2(56.5,4) v2(56.5,1.5) v2(59,24) v2(59,21.5) v2(59,14) v2(59,4) v2(59,1.5) v2(60.5,45.5) v2(60.5,25.5) v2(60.5,5.5) v2(61.5,6.5) v2(61.5,4) v2(61.5,1.5) v2(64,21.5) v2(64,1.5) v2(65.5,45.5) v2(65.5,40.5) v2(65.5,5.5) v2(66.5,6.5) v2(66.5,1.5) v2(69,6.5) v2(70.5,45.5) v2(70.5,10.5) v2(71.5,16.5) v2(74,26.5) v2(74,21.5) v2(74,19) v2(74,16.5) v2(75.5,45.5) v2(75.5,40.5) v2(75.5,20.5) v2(75.5,10.5) v2(76.5,24) v2(76.5,21.5) v2(76.5,19) v2(76.5,16.5) v2(79,26.5) v2(79,24) v2(79,21.5) v2(79,19) v2(79,16.5) v2(80.5,45.5) v2(80.5,40.5) v2(80.5,30.5) v2(80.5,25.5) v2(80.5,20.5) v2(80.5,10.5) v2(81.5,26.5) v2(81.5,24) v2(81.5,21.5) v2(81.5,19) v2(81.5,16.5) v2(84,29) v2(84,26.5) v2(84,24) v2(84,21.5) v2(84,19) v2(84,16.5) v2(85.5,45.5) v2(85.5,25.5) v2(85.5,20.5) v2(85.5,10.5) v2(86.5,29) v2(86.5,24) v2(86.5,21.5) v2(86.5,16.5) v2(89,19) v2(89,16.5) v2(90.5,45.5) v2(90.5,40.5) v2(90.5,25.5) v2(90.5,20.5) v2(90.5,10.5) v2(91.5,31.5) v2(91.5,21.5) v2(91.5,19) v2(91.5,16.5) v2(95.5,45.5) v2(95.5,10.5) v2(96.5,11.5) v2(99,9) v2(100.5,45.5) v2(100.5,40.5) v2(100.5,15.5) v2(100.5,10.5) v2(101.5,9) v2(104,24) v2(104,19) v2(104,6.5) v2(105.5,45.5) v2(106.5,26.5) v2(106.5,24) v2(109,46.5) v2(109,44) v2(109,11.5) v2(109,9) v2(110.5,40.5) v2(110.5,35.5) v2(110.5,30.5) v2(110.5,25.5) v2(110.5,20.5) v2(110.5,15.5) v2(110.5,10.5) v3(12.75,26.5) v3(13.75,26.5) v3(14.75,26.5) v3(40.75,26.5) v3(41.75,26.5) v3(42.75,26.5) v3(68.75,26.5) v3(69.75,26.5) v3(70.75,26.5) v3(96.75,26.5) v3(97.75,26.5) v3(98.75,26.5)
VCC: length 177.7
  Top Layer w0.254: U38.37 U38.36
  Top Layer w0.5: SJ3.2 102.75,13 v1(99,13) ; 63.5,9.29 63.5,9.28 v1(63.5,7) v1(63.5,6)
  Bottom Layer w0.254: C5.1 IC3.20 ; IC1.20 C3.1 9.45,25.05 10.5,24 10.5,13 14,9.5 19.75,9.5 v1(20,9.75) v1(20,8.25) ; 30.5,17.5 37.45,24.45 C4.1 IC2.20 ; C6.1 IC4.20
  Bottom Layer w0.5: 85.5,17.5 93.45,25.45 C6.1 ; 85.5,17.5 63.51,17.5 ; 85.5,17.5 94.5,17.5 v1(99,13) ; C8.1 C7.1 23.25,8 v1(23,8.25) ; C8.1 v1(23,9.75) ; C8.1 24.8,16.3 26,17.5 58.5,17.5 ; 63.51,17.5 63.5,17.49 v1(63.5,7) ; 63.51,17.5 58.5,17.5 ; 58.5,17.5 65,24 65,26.2 C5.1 ; v1(63.5,5) v1(63.5,6)
DIR1: length 56.2
  Top Layer w0.254: 45.75,9 U38.1 45.75,10.5 43.5,12.75 12.75,12.75 12.5,13 v1(12.5,20.5) 11,19 5.1,19 LED1.1
  Bottom Layer w0.254: IC1.18 v1(12.5,20.5)
DIR2: length 71.4
  Top Layer w0.254: LED2.1 5,24 6,23 13,23 13.5,22.5 v1(13.5,20.5) 13.5,13.5 13.75,13.25 43.75,13.25 46.25,10.75 U38.2
  Bottom Layer w0.254: IC1.17 13,21.5 13.5,21 v1(13.5,20.5)
DIR3: length 68
  Top Layer w0.254: LED3.1 8.5,25 9.5,24 13.25,24 14.5,22.75 v1(14.5,20.5) 14.5,14 14.75,13.75 44,13.75 46.75,11 U38.3
  Bottom Layer w0.254: IC1.16 13.5,22 14.5,21 v1(14.5,20.5)
DIR4: length 68
  Top Layer w0.254: LED4.1 12,32.5 9.75,30.25 9.75,25.75 10.5,25 13.5,25 15.5,23 v1(15.5,20.5) 15.5,14.5 15.75,14.25 44.25,14.25 47.25,11.25 U38.4
  Bottom Layer w0.254: v1(15.5,20.5) 15.5,21 14,22.5 IC1.15
DIR5: length 62.9
  Top Layer w0.254: U38.5 47.75,9.29 47.75,11.5 44.5,14.75 16.75,14.75 16.5,15 v1(16.5,20.5) 16.5,25 15.5,26 LED5.1
  Bottom Layer w0.254: IC1.14 14.5,23 16.5,21 v1(16.5,20.5)
DIR6: length 62.6
  Top Layer w0.254: U38.6 48.25,11.75 44.75,15.25 17.75,15.25 17.5,15.5 v1(17.5,20.5) 17.5,22.5 19,24 LED6.1
  Bottom Layer w0.254: v1(17.5,20.5) 17.5,21 15,23.5 IC1.13
DIR7: length 63.2
  Top Layer w0.254: LED7.1 22.5,26 18.5,22 v1(18.5,20.5) 18.5,16 18.75,15.75 45,15.75 48.75,12 U38.7
  Bottom Layer w0.254: IC1.12 15.5,24 18.5,21 v1(18.5,20.5)
DIR8: length 65.2
  Top Layer w0.254: U38.8 49.25,12.25 45.25,16.25 19.75,16.25 19.5,16.5 v1(19.5,20.5) 19.5,21.5 26,28 LED8.1
  Bottom Layer w0.254: v1(19.5,20.5) 19.5,21 17,23.5 17,26 16.75,26.25 IC1.11
DIR9: length 47.7
  Top Layer w0.254: LED9.1 29.5,36.94 29.5,27.5 33.5,23.5 39,23.5 40.5,22 v1(40.5,20.5) 44.25,16.75 50,16.75 50.25,16.5 U38.10
  Bottom Layer w0.254: IC2.18 v1(40.5,20.5)
DIR10: length 45
  Top Layer w0.254: U38.11 50.75,16.75 50.25,17.25 44.75,17.25 v1(41.5,20.5) 41.5,22.5 39.5,24.5 36.5,24.5 33,28 LED10.1
  Bottom Layer w0.254: IC2.17 41,21.5 41.5,21 v1(41.5,20.5)
DIR11: length 42.9
  Top Layer w0.254: U38.12 51.25,17 50.5,17.75 45.25,17.75 v1(42.5,20.5) 42.5,23 40,25.5 38.5,25.5 36.5,27.5 LED11.1
  Bottom Layer w0.254: v1(42.5,20.5) 42.5,21 41.5,22 IC2.16
DIR12: length 41.2
  Top Layer w0.254: U38.13 51.75,17.25 50.75,18.25 45.75,18.25 v1(43.5,20.5) 43.5,23.5 44,24 44,27.5 40,31.5 LED12.1
  Bottom Layer w0.254: v1(43.5,20.5) 43.5,21 42,22.5 IC2.15
DIR13: length 40.9
  Top Layer w0.254: U38.14 52.25,17.5 51,18.75 46.25,18.75 v1(44.5,20.5) 44.5,23 46,24.5 46,28.5 43.5,31 LED13.1
  Bottom Layer w0.254: v1(44.5,20.5) 44.5,21 42.5,23 IC2.14
DIR14: length 39.7
  Top Layer w0.254: U38.15 52.75,17.75 51.25,19.25 46.75,19.25 v1(45.5,20.5) 45.5,22.5 47,24 LED14.1
  Bottom Layer w0.254: v1(45.5,20.5) 45.5,21 43,23.5 IC2.13
DIR15: length 40.6
  Top Layer w0.254: U38.16 53.25,18 51.5,19.75 47.25,19.75 v1(46.5,20.5) 46.5,22 50.5,26 LED15.1
  Bottom Layer w0.254: IC2.12 43.5,24 46.5,21 v1(46.5,20.5)
DIR16: length 42.9
  Top Layer w0.254: U38.17 53.75,18.25 51.75,20.25 47.75,20.25 v1(47.5,20.5) 47.5,21.5 54,28 LED16.1
  Bottom Layer w0.254: IC2.11 44.75,26.25 45,26 45,23.5 47.5,21 v1(47.5,20.5)
DIR17: length 47.9
  Top Layer w0.254: LED17.1 57.5,27.5 61.5,23.5 64.5,23.5 66,22 v1(66,20.5) 66,20.25 65.25,19.5 57.5,19.5 54.75,16.75 U38.19 54.75,9.29
  Bottom Layer w0.254: v1(66,20.5) 66,21 68.5,23.5 IC3.18
DIR18: length 46.9
  Top Layer w0.254: U38.20 55.25,16.5 57.75,19 66,19 67,20 v1(67,20.5) 67,22.5 65,24.5 62.5,24.5 61,26 LED18.1
  Bottom Layer w0.254: v1(67,20.5) 67,21 69,23 IC3.17
DIR19: length 44.5
  Top Layer w0.254: U38.21 55.75,16.25 58,18.5 66.5,18.5 68,20 v1(68,20.5) 68,23 64.5,26.5 LED19.1
  Bottom Layer w0.254: IC3.16 69.5,22.5 68,21 v1(68,20.5)
DIR20: length 43.6
  Top Layer w0.254: LED20.1 68,24.5 69,23.5 v1(69,20.5) 69,20 67,18 58.25,18 56.25,16 U38.22
  Bottom Layer w0.254: IC3.15 70,22 69,21 v1(69,20.5)
DIR21: length 44
  Top Layer w0.254: LED21.1 71.5,24.5 70,23 v1(70,20.5) 70,20 67.5,17.5 58.5,17.5 56.75,15.75 U38.23
  Bottom Layer w0.254: v1(70,20.5) 70,21 70.5,21.5 IC3.14
DIR22: length 45.2
  Top Layer w0.254: LED22.1 75,26.5 71,22.5 v1(71,20.5) 71,20 68,17 58.75,17 57.25,15.5 U38.24
  Bottom Layer w0.254: v1(71,20.5) IC3.13
DIR23: length 46.8
  Top Layer w0.254: LED23.1 78.5,28.5 72,22 v1(72,20.5) 72,20 68.5,16.5 59,16.5 57.75,15.25 U38.25
  Bottom Layer w0.254: v1(72,20.5) 72,24.8 IC3.12
DIR24: length 50.2
  Top Layer w0.254: U38.26 58.25,15 59.25,16 69,16 73,20 v1(73,20.5) 73,21.5 82,30.5 LED24.1
  Bottom Layer w0.254: IC3.11 72.75,26.25 73.5,25.5 73.5,24.5 73,24 v1(73,20.5)
DIR25: length 71.1
  Top Layer w0.254: U38.28 59.25,12.5 62.25,15.5 92.5,15.5 94,17 v1(94,20.5) 94,22 92.5,23.5 89,23.5 85.5,27 LED25.1
  Bottom Layer w0.254: IC4.18 96.5,23.5 94,21 v1(94,20.5)
DIR26: length 69.5
  Top Layer w0.254: LED26.1 89,26 90.5,24.5 93,24.5 95,22.5 v1(95,20.5) 95,17.25 92.75,15 62.5,15 59.75,12.25 U38.29
  Bottom Layer w0.254: v1(95,20.5) 95,21 97,23 IC4.17
DIR27: length 67
  Top Layer w0.254: U38.30 60.25,12 62.75,14.5 93,14.5 96,17.5 v1(96,20.5) 96,23 92.5,26.5 LED27.1
  Bottom Layer w0.254: v1(96,20.5) 96,21 97.5,22.5 IC4.16
DIR28: length 66.4
  Top Layer w0.254: LED28.1 96,31 95.5,30.5 95.5,25 97,23.5 v1(97,20.5) 97,17.75 93.25,14 63,14 60.75,11.75 U38.31
  Bottom Layer w0.254: v1(97,20.5) 97,21 98,22 IC4.15
DIR29: length 66.2
  Top Layer w0.254: U38.32 61.25,11.5 63.25,13.5 93.5,13.5 98,18 v1(98,20.5) 98,23.5 99.5,25 LED29.1
  Bottom Layer w0.254: IC4.14 98.5,21.5 98,21 v1(98,20.5)
DIR30: length 67.2
  Top Layer w0.254: U38.33 61.75,11.25 63.5,13 93.75,13 99,18.25 v1(99,20.5) 99,23 103,27 LED30.1
  Bottom Layer w0.254: v1(99,20.5) IC4.13
DIR31: length 68.8
  Top Layer w0.254: U38.34 62.25,11 63.75,12.5 94,12.5 100,18.5 v1(100,20.5) 100,22.5 106.44,28.94 LED31.1
  Bottom Layer w0.254: v1(100,20.5) 100,24.8 IC4.12
DIR32: length 57.5
  Top Layer w0.254: LED32.1 105.1,20.5 v1(101,20.5) 101,18.75 94.25,12 64,12 62.75,10.75 U38.35
  Bottom Layer w0.254: IC4.11 100.75,26.25 101,26 v1(101,20.5)
IR1: length 32.6
  Top Layer w0.254: v1(6,29) NOREF#12.75
  Bottom Layer w0.254: IC1.2 12,28.5 11.25,29.25 7.25,29.25 6.5,28.5 ; 6.5,28.5 v1(6,29) ; 6.5,28.5 6.5,25.5 7.25,24.75 7.75,24.75 9,23.5 9,13 8.75,12.75 6.5,12.75 5.75,13.5 5.75,14.5 R2.2 5.64,14.62 IR1.3
IR2: length 17.3
  Top Layer w0.254: v1(6.99,32.51) 7,32.52 NOREF#30.74
  Bottom Layer w0.254: 7,32.5 v1(6.99,32.51) 5.75,32.51 ; IR2.3 5.64,34.62 R4.2 5.75,32.51 ; 5.75,32.51 5.75,31.25 7,30 12,30 12.5,29.5 IC1.3
IR3: length 14.6
  Top Layer w0.254: v1(10.5,32.5) NOREF#31.73
  Bottom Layer w0.254: IR3.3 9.14,34.62 R6.2 9.25,32.37 ; 9.25,32.37 9.25,31.5 10,30.75 12.5,30.75 13,30.25 IC1.4 ; 9.25,32.37 9.38,32.5 v1(10.5,32.5)
IR4: length 12
  Top Layer w0.254: v1(14,32.5) NOREF#21.72
  Bottom Layer w0.254: IC1.5 13.5,30.75 12.75,31.5 12.75,32.34 ; 12.75,32.34 12.75,34.5 R8.2 12.64,34.62 IR4.3 ; 12.75,32.34 12.91,32.5 v1(14,32.5)
IR5: length 12.5
  Top Layer w0.254: v1(17.49,32.49) 17.5,32.5 NOREF#34.71
  Bottom Layer w0.254: 16.25,32.49 16.25,34.5 R10.2 16.14,34.62 IR5.3 ; 16.25,32.49 16.25,31.75 14,29.5 IC1.6 ; 16.25,32.49 v1(17.49,32.49) 17.5,32.5
IR6: length 16.3
  Top Layer w0.254: v1(21,32.5) NOREF#27.70
  Bottom Layer w0.254: v1(21,32.5) 19.81,32.5 19.75,32.44 ; IC1.7 14.5,29.25 14.75,29.5 19,29.5 19.75,30.25 19.75,32.44 ; 19.75,32.44 19.75,34.5 R12.2 19.64,34.62 IR6.3
IR7: length 19.2
  Top Layer w0.254: NOREF#17.69 24.5,32.5 v1(24.5,32.5)
  Bottom Layer w0.254: 23.25,32.5 23.25,32.5 R14.2 23.14,34.62 IR7.3 ; 23.25,32.5 v1(24.5,32.5) 24.5,32.5 ; 23.25,32.5 23.25,29.75 22.5,29 15.25,29 15,28.75 IC1.8
IR8: length 22
  Top Layer w0.254: v1(28,32.5) NOREF#13.68
  Bottom Layer w0.254: 26.75,32.49 26.76,32.5 v1(28,32.5) ; 26.75,32.49 26.75,34.5 R16.2 26.64,34.62 IR8.3 ; 26.75,32.49 26.75,29.75 25.5,28.5 15.75,28.5 15.5,28.25 IC1.9
IR9: length 20
  Top Layer w0.254: v1(31.5,32.5) NOREF#32.67
  Bottom Layer w0.254: IR9.3 30.14,34.62 R18.2 30.25,34.5 30.25,32.49 ; 30.25,32.49 30.26,32.5 v1(31.5,32.5) ; 30.25,32.49 30.25,30.25 31.25,29.25 38.81,29.25 40,28.06 IC2.2
IR10: length 17
  Top Layer w0.254: v1(35,32.5) NOREF#29.66
  Bottom Layer w0.254: 33.75,32.44 33.81,32.5 v1(35,32.5) ; 33.75,32.44 33.75,34.5 R20.2 33.63,34.62 IR10.3 ; 33.75,32.44 33.75,30.75 34.5,30 39,30 40.5,28.5 IC2.3
IR11: length 13.9
  Top Layer w0.254: v1(38.5,32.5) NOREF#6.65
  Bottom Layer w0.254: 37.25,32.35 37.25,34.5 R22.2 37.13,34.62 IR11.3 ; 37.25,32.35 37.25,31.5 38,30.75 39.25,30.75 41,29 IC2.4 ; 37.25,32.35 37.4,32.5 v1(38.5,32.5)
IR12: length 11.9
  Top Layer w0.254: v1(42,32.5) NOREF#37.64
  Bottom Layer w0.254: 40.75,32.5 40.75,30.25 41.5,29.5 IC2.5 ; 40.75,32.5 42,32.5 v1(42,32.5) ; 40.75,32.5 40.75,34.5 R24.2 40.63,34.62 IR12.3
IR13: length 12.5
  Top Layer w0.254: v1(45.5,32.5) NOREF#18.63
  Bottom Layer w0.254: 44.25,32.58 44.25,34.5 R26.2 44.13,34.62 IR13.3 ; 44.25,32.58 44.33,32.5 v1(45.5,32.5) ; 44.25,32.58 44.25,31.75 42,29.5 IC2.6
IR14: length 15.5
  Top Layer w0.254: v1(49,32.5) NOREF#15.62
  Bottom Layer w0.254: 47.75,32.56 47.81,32.5 v1(49,32.5) ; 47.75,32.56 47.75,34.5 R28.2 47.63,34.62 IR14.3 ; 47.75,32.56 47.75,31.25 46.5,30 43.5,30 42.5,29 IC2.7
IR15: length 18.5
  Top Layer w0.254: v1(52.5,32.5) NOREF#35.61
  Bottom Layer w0.254: IR15.3 51.13,34.62 R30.2 51.25,34.5 51.25,32.44 ; 51.25,32.44 51.31,32.5 v1(52.5,32.5) ; 51.25,32.44 51.25,30.75 50,29.5 44,29.5 43,28.5 IC2.8
IR16: length 21.8
  Top Layer w0.254: NOREF#7.60 56,32.51 v1(55.99,32.51)
  Bottom Layer w0.254: IR16.3 54.63,34.62 R32.2 54.75,34.5 54.75,32.51 ; 54.75,32.51 v1(55.99,32.51) 56,32.5 ; 54.75,32.51 54.75,29.75 54,29 44.44,29 43.5,28.06 IC2.9
IR17: length 19.9
  Top Layer w0.254: v1(59.5,32.5) NOREF#23.59
  Bottom Layer w0.254: 58.25,32.49 58.25,34.5 R34.2 58.13,34.62 IR17.3 ; 58.25,32.49 58.26,32.5 v1(59.5,32.5) ; 58.25,32.49 58.25,30.5 59.75,29 67.06,29 68,28.06 IC3.2
IR18: length 16.9
  Top Layer w0.254: v1(63,32.5) NOREF#3.58
  Bottom Layer w0.254: IR18.3 61.63,34.62 R36.2 61.75,34.5 61.75,32.46 ; 61.75,32.46 61.75,30.75 63,29.5 67.25,29.5 68.5,28.25 IC3.3 ; 61.75,32.46 61.78,32.5 v1(63,32.5)
IR19: length 13.6
  Top Layer w0.254: v1(66.5,32.5) NOREF#4.57
  Bottom Layer w0.254: 65.25,32.47 65.28,32.5 v1(66.5,32.5) ; 65.25,32.47 65.25,31.5 66.75,30 67.5,30 69,28.5 IC3.4 ; 65.25,32.47 65.25,34.5 R38.2 65.13,34.62 IR19.3
IR20: length 11.9
  Top Layer w0.254: v1(70,32.5) NOREF.56
  Bottom Layer w0.254: IR20.3 68.63,34.62 R40.2 68.75,34.5 68.75,32.51 ; 68.75,32.51 69.99,32.51 v1(70,32.5) ; 68.75,32.51 68.75,29.75 69.5,29 IC3.5
IR21: length 12.5
  Top Layer w0.254: v1(73.5,32.5) NOREF#36.55
  Bottom Layer w0.254: v1(73.5,32.5) 73.5,32.5 72.25,32.5 ; 72.25,32.5 R42.2 72.13,34.62 IR21.3 ; 72.25,32.5 72.25,31.25 70,29 IC3.6
IR22: length 15.1
  Top Layer w0.254: v1(76.98,32.48) 76.98,33.98 NOREF#26.54
  Bottom Layer w0.254: 75.75,32.48 R44.2 75.63,34.62 IR22.3 ; 75.75,32.48 75.75,31.5 73.75,29.5 71.5,29.5 70.5,28.5 IC3.7 ; 75.75,32.48 v1(76.98,32.48) 77,32.5
IR23: length 18.4
  Top Layer w0.254: v1(80.5,32.5) NOREF#2.53
  Bottom Layer w0.254: 79.25,32.5 v1(80.5,32.5) ; IR23.3 79.13,34.62 R46.2 79.25,34.5 79.25,30.75 77.5,29 71.75,29 71,28.25 IC3.8
IR24: length 21.6
  Top Layer w0.254: v1(84,32.5) NOREF#40.52
  Bottom Layer w0.254: IC3.9 71.5,28.06 71.94,28.5 81,28.5 82.75,30.25 82.75,32.53 ; v1(84,32.5) 82.78,32.5 82.75,32.53 ; IR24.3 82.63,34.62 R48.2 82.75,32.53
IR25: length 20.3
  Top Layer w0.254: v1(87.5,32.5) NOREF#24.51
  Bottom Layer w0.254: 86.25,32.5 86.25,30.5 87.5,29.25 95.5,29.25 96,28.75 IC4.2 ; 86.25,32.5 86.25,34.5 R50.2 86.13,34.62 IR25.3 ; 86.25,32.5 87,32.5 87,32.5 v1(87.5,32.5)
IR26: length 17.3
  Top Layer w0.254: v1(91,32.5) NOREF#38.50
  Bottom Layer w0.254: IR26.3 89.63,34.62 R52.2 ; 89.75,32.52 89.75,31.25 91.25,29.75 96.25,29.75 96.5,29.5 IC4.3 ; 89.75,32.52 89.75,34.5 ; 89.75,32.52 90.98,32.52 v1(91,32.5)
IR27: length 14.3
  Top Layer w0.254: v1(94.5,32.5) NOREF#5.49
  Bottom Layer w0.254: 93.25,34.5 93.25,32.49 ; 93.25,32.49 93.25,31.5 94.5,30.25 96.5,30.25 97,29.75 IC4.4 ; 93.25,32.49 93.26,32.5 v1(94.5,32.5) ; R54.2 93.13,34.62 IR27.3
IR28: length 11.9
  Top Layer w0.254: v1(98,32.5) NOREF#25.48
  Bottom Layer w0.254: IR28.3 96.63,34.62 R56.2 ; 96.75,32.53 97.97,32.53 v1(98,32.5) ; 96.75,32.53 96.75,34.5 96.75,34.5 ; 96.75,32.53 96.75,30.75 97.5,30 IC4.5
IR29: length 12.5
  Top Layer w0.254: v1(101.5,32.5) NOREF#8.47
  Bottom Layer w0.254: 100.25,32.58 100.33,32.5 v1(101.5,32.5) ; 100.25,32.58 100.25,32 98,29.75 IC4.6 ; 100.25,32.58 100.25,34.5 100.25,34.5 ; R58.2 100.13,34.62 IR29.3
IR30: length 15.5
  Top Layer w0.254: v1(105,32.5) NOREF#11.46
  Bottom Layer w0.254: IR30.3 103.63,34.61 103.75,34.5 ; 103.75,34.5 103.75,34.5 103.75,32.51 ; 103.75,32.51 104.99,32.51 v1(105,32.5) ; 103.75,32.51 103.75,31.25 102.5,30 99.5,30 98.5,29 IC4.7
IR31: length 18.9
  Top Layer w0.254: NOREF#39.45 108.25,33.25 v1(108.25,32.5)
  Bottom Layer w0.254: 107.25,32.5 107.25,32.5 107.25,30.5 106.25,29.5 99.75,29.5 99,28.75 IC4.8 ; 107.25,32.5 107.25,34.5 ; 107.25,32.5 v1(108.25,32.5) ; R96.2 107.13,34.62 IR31.3
IR32: length 37.5
  Top Layer w0.254: v1(107.5,28) NOREF#28.76
  Bottom Layer w0.254: IR32.3 107.13,14.62 R98.2 107.25,13.25 106.5,12.5 102,12.5 101.5,13 101.5,19.5 105.5,23.5 105.5,27.5 ; 105.5,27.5 106,28 v1(107.5,28) ; 105.5,27.5 104,29 100,29 99.5,28.5 IC4.9
$1N6653: length 2.2
  Bottom Layer w0.254: R3.1 4.36,41.38 IR2.2
$1N6781: length 2.2
  Bottom Layer w0.254: IR3.2 7.86,41.38 R5.1
$1N6909: length 2.2
  Bottom Layer w0.254: R7.1 11.36,41.38 IR4.2
$1N7037: length 2.2
  Bottom Layer w0.254: R9.1 14.86,41.38 IR5.2
$1N7165: length 2.2
  Bottom Layer w0.254: R11.1 18.36,41.38 IR6.2
$1N7293: length 2.2
  Bottom Layer w0.254: R13.1 21.86,41.38 IR7.2
$1N7421: length 2.2
  Bottom Layer w0.254: IR8.2 25.36,41.38 R15.1
$1N7549: length 2.2
  Bottom Layer w0.254: R17.1 28.86,41.38 IR9.2
$1N7677: length 2.2
  Bottom Layer w0.254: R19.1 32.37,41.38 IR10.2
$1N7805: length 2.2
  Bottom Layer w0.254: R21.1 35.87,41.38 IR11.2
$1N7933: length 2.2
  Bottom Layer w0.254: R23.1 39.37,41.38 IR12.2
$1N8061: length 2.2
  Bottom Layer w0.254: R25.1 42.87,41.38 IR13.2
$1N8189: length 2.2
  Bottom Layer w0.254: IR14.2 46.37,41.38 R27.1
$1N8317: length 2.2
  Bottom Layer w0.254: IR15.2 49.87,41.38 R29.1
$1N8445: length 2.2
  Bottom Layer w0.254: R31.1 53.37,41.38 IR16.2
$1N10253: length 2.2
  Bottom Layer w0.254: IR17.2 56.87,41.38 R33.1
$1N10265: length 2.2
  Bottom Layer w0.254: R35.1 60.37,41.38 IR18.2
$1N10277: length 2.2
  Bottom Layer w0.254: IR19.2 63.87,41.38 R37.1
$1N10289: length 2.2
  Bottom Layer w0.254: IR20.2 67.37,41.38 R39.1
$1N10301: length 2.2
  Bottom Layer w0.254: IR21.2 70.87,41.38 R41.1
$1N10313: length 2.2
  Bottom Layer w0.254: R43.1 74.37,41.38 IR22.2
$1N10325: length 2.2
  Bottom Layer w0.254: IR23.2 77.87,41.38 R45.1
$1N10337: length 2.2
  Bottom Layer w0.254: IR24.2 81.37,41.38 R47.1
$1N10349: length 2.2
  Bottom Layer w0.254: IR25.2 84.87,41.38 R49.1
$1N10361: length 2.3
  Bottom Layer w0.254: IR26.2 88.37,41.36 88.15,41.58
$1N10373: length 2.2
  Bottom Layer w0.254: IR27.2 91.87,41.38 R53.1
$1N10385: length 2.2
  Bottom Layer w0.254: R55.1 95.37,41.38 IR28.2
$1N10397: length 2.2
  Bottom Layer w0.254: R57.1 98.87,41.38 IR29.2
$1N10409: length 2.2
  Bottom Layer w0.254: IR30.2 102.37,41.38 R59.1
$1N20190: length 2.2
  Top Layer w0.254: LED1.2 5,16.9 R63.1
$1N20287: length 2.7
  Top Layer w0.254: LED2.2 4.25,39.85 R64.1
$1N20383: length 2.7
  Top Layer w0.254: R65.1 7.75,39.85 LED3.2
$1N20385: length 2.7
  Top Layer w0.254: R66.1 11.25,39.85 LED4.2
$1N20575: length 2.7
  Top Layer w0.254: LED5.2 14.75,39.85 R67.1
$1N20577: length 2.7
  Top Layer w0.254: LED6.2 18.25,39.85 R68.1
$1N20579: length 2.7
  Top Layer w0.254: LED7.2 21.75,39.85 R69.1
$1N20581: length 2.7
  Top Layer w0.254: R70.1 25.25,39.85 LED8.2
$1N20959: length 2.6
  Top Layer w0.254: R71.1 28.75,40.04 LED9.2
$1N20961: length 2.7
  Top Layer w0.254: LED10.2 32.25,39.85 R72.1
$1N20963: length 2.7
  Top Layer w0.254: LED11.2 35.76,39.84 R73.1
$1N20965: length 2.7
  Top Layer w0.254: LED12.2 39.25,39.85 R74.1
$1N20967: length 2.7
  Top Layer w0.254: R75.1 42.75,39.85 LED13.2
$1N20969: length 2.7
  Top Layer w0.254: LED14.2 46.25,39.85 R76.1
$1N20971: length 2.7
  Top Layer w0.254: LED15.2 49.75,39.85 R77.1
$1N20973: length 2.7
  Top Layer w0.254: LED16.2 53.25,39.85 R78.1
$1N22511: length 2.7
  Top Layer w0.254: LED17.2 56.75,39.85 R79.1
$1N22513: length 2.7
  Top Layer w0.254: LED18.2 60.25,39.85 R80.1
$1N22515: length 2.7
  Top Layer w0.254: R81.1 63.75,39.85 LED19.2
$1N22517: length 2.7
  Top Layer w0.254: LED20.2 67.25,39.85 R82.1
$1N22519: length 2.7
  Top Layer w0.254: LED21.2 70.75,39.85 R83.1
$1N22521: length 2.7
  Top Layer w0.254: R84.1 74.25,39.85 LED22.2
$1N22523: length 2.7
  Top Layer w0.254: LED23.2 77.75,39.85 R85.1
$1N22525: length 2.7
  Top Layer w0.254: R86.1 81.25,39.85 LED24.2
$1N22527: length 2.7
  Top Layer w0.254: LED25.2 84.75,39.85 R87.1
$1N22529: length 2.7
  Top Layer w0.254: LED26.2 88.25,39.85 R88.1
$1N22531: length 2.7
  Top Layer w0.254: LED27.2 91.75,39.85 R89.1
$1N22533: length 2.7
  Top Layer w0.254: R90.1 95.25,39.85 LED28.2
$1N22535: length 2.7
  Top Layer w0.254: LED29.2 98.75,39.85 R91.1
$1N22537: length 2.7
  Top Layer w0.254: R92.1 102.25,39.85 LED30.2
$1N22539: length 2.6
  Top Layer w0.254: LED31.2 105.75,39.9 R93.1
$1N22541: length 2.4
  Top Layer w0.254: LED32.2 106.5,16.9 R94.1
$1N26335: length 2.2
  Bottom Layer w0.254: R1.1 4.36,21.38 IR1.2
$1N29013: length 232.6
  Top Layer w0.4: 93.16,43.5 93.25,43.41 R89.2 ; 93.16,43.5 96.73,43.5 ; 93.16,43.5 89.79,43.5 ; R87.2 86.25,43.48 86.23,43.5 ; 82.79,43.5 79.26,43.5 ; 82.79,43.5 86.23,43.5 ; 82.79,43.5 82.75,43.46 R86.2 ; 79.26,43.5 75.72,43.5 ; 79.26,43.5 79.25,43.49 R85.2 ; 65.27,43.5 65.25,43.48 R81.2 ; 65.27,43.5 61.77,43.5 ; 65.27,43.5 72.2,43.5 ; 61.77,43.5 61.75,43.49 R80.2 ; 61.77,43.5 58.26,43.5 ; 102.75,14.5 R94.2 105,14.5 105,13.5 105.5,13 108.5,13 109,13.5 109,42.5 108,43.5 106.5,43.5 ; 106.5,43.5 103.78,43.5 ; 106.5,43.5 107.25,42.75 R93.2 ; 51.23,43.5 51.26,43.47 R77.2 ; 51.23,43.5 54.75,43.5 ; 51.23,43.5 47.77,43.5 ; 103.78,43.5 100.31,43.5 ; 103.78,43.5 103.75,43.48 103.75,41.5 ; 33.75,43.5 30.24,43.5 ; 33.75,43.5 37.23,43.5 ; 33.75,43.5 33.75,43.49 R72.2 ; 30.24,43.5 30.25,43.48 R71.2 ; 30.24,43.5 26.76,43.5 ; 54.75,43.5 54.75,43.49 54.75,41.5 ; 54.75,43.5 58.26,43.5 ; 16.24,43.5 16.25,43.48 R67.2 ; 16.24,43.5 12.71,43.5 ; 16.24,43.5 19.75,43.5 ; R68.2 19.75,43.5 19.75,43.5 ; 37.23,43.5 40.76,43.5 ; 37.23,43.5 37.26,43.47 R73.2 ; 86.23,43.5 89.79,43.5 ; R66.2 12.75,43.46 12.71,43.5 ; 72.2,43.5 72.25,43.44 R83.2 ; 72.2,43.5 75.72,43.5 ; R82.2 68.75,43.5 ; 40.76,43.5 47.77,43.5 ; 40.76,43.5 40.75,43.49 R74.2 ; 47.77,43.5 47.75,43.48 R76.2 ; R63.2 3.5,14.75 3.5,16 3,16.5 3,43 3.5,43.5 6.5,43.5 ; 26.76,43.5 23.26,43.5 ; 26.76,43.5 26.75,43.49 R70.2 ; 23.26,43.5 23.25,43.5 R69.2 ; 23.26,43.5 19.75,43.5 ; R84.2 75.75,43.46 75.72,43.5 ; R64.2 5.75,42.75 6.5,43.5 ; 12.71,43.5 9.27,43.5 ; 89.79,43.5 89.75,43.46 R88.2 ; 96.73,43.5 100.31,43.5 ; 96.73,43.5 96.75,43.47 R90.2 ; 6.5,43.5 9.27,43.5 ; 9.27,43.5 9.25,43.48 R65.2 ; 100.31,43.5 100.31,41.55 R91.2 ; 58.25,41.5 58.25,43.49 58.26,43.5 ; R75.2 44.25,43.5
$1N30161: length 2.2
  Bottom Layer w0.254: IR31.2 105.87,41.38 R95.1
$1N30166: length 2.2
  Bottom Layer w0.254: IR32.2 105.87,21.38 R97.1

## Copper pours and planes (outline as drawn; the poured copper is in the pictures)
AGND on Top Layer: -17.5,56 139.5,56 139.5,-7.5 -17.5,-7.5
AGND on Bottom Layer: -6,69 120,69 120,-4 -6,-4

## Text on the board
Top Silkscreen Layer: Test outputs | IR2 | IR1 | IR3 | IR4 | IR5 | IR6 | IR7 | IR8 | IR9 | IR10 | IR11 | IR12 | IR13 | IR14 | IR15 | IR16 | IR17 | IR18 | IR19 | IR20 | IR21 | IR22 | IR23 | IR24 | IR25 | IR26 | IR27 | IR28 | IR29 | IR30 | IR31 | IR32 | 3,3V | GND | 5V | Line follower sensor array V1
